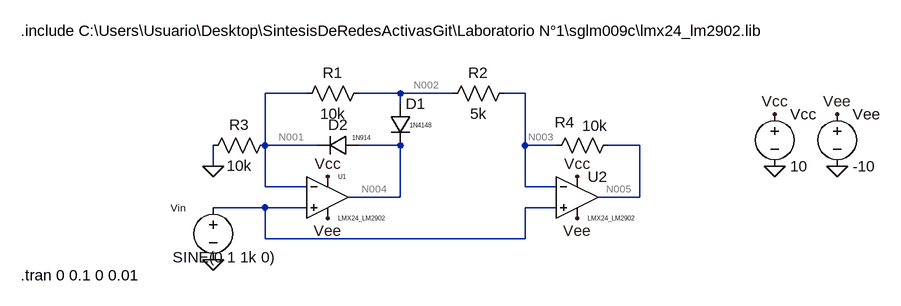
[diagram p0: schematic Laboratorio1-CircuitoIII.asc]
Laboratorio1-CircuitoIII.asc, the LTspice schematic file:
Version 4
SHEET 1 1160 680
WIRE 192 0 128 0
WIRE 336 0 272 0
WIRE 416 0 336 0
WIRE 528 0 496 0
WIRE 336 16 336 0
WIRE 128 80 128 0
WIRE 208 80 128 80
WIRE 336 80 272 80
WIRE 528 80 528 0
WIRE 576 80 528 80
WIRE 704 80 656 80
WIRE 48 112 48 80
WIRE 128 144 128 80
WIRE 192 144 128 144
WIRE 528 144 528 80
WIRE 576 144 528 144
WIRE 336 160 336 80
WIRE 336 160 256 160
WIRE 704 160 704 80
WIRE 704 160 640 160
WIRE 128 176 48 176
WIRE 192 176 128 176
WIRE 576 176 528 176
WIRE 128 224 128 176
WIRE 528 224 528 176
WIRE 528 224 128 224
FLAG 48 112 0
FLAG 48 256 0
FLAG 912 112 0
FLAG 1008 112 0
FLAG 912 32 Vcc
FLAG 608 128 Vcc
FLAG 224 128 Vcc
FLAG 1008 32 Vee
FLAG 608 192 Vee
FLAG 224 192 Vee
SYMBOL OpAmps\\opamp2 224 96 R0
WINDOW 3 16 96 Left 0
WINDOW 0 16 32 Left 0
SYMATTR Value LMX24_LM2902
SYMATTR InstName U1
SYMBOL OpAmps\\opamp2 608 96 R0
WINDOW 3 16 96 Left 0
SYMATTR Value LMX24_LM2902
SYMATTR InstName U2
SYMBOL diode 320 16 R0
WINDOW 3 30 33 Left 0
SYMATTR InstName D1
SYMATTR Value 1N4148
SYMBOL diode 272 96 M270
WINDOW 0 32 32 VTop 2
WINDOW 3 34 -5 VBottom 0
SYMATTR InstName D2
SYMATTR Value 1N914
SYMBOL res 288 -16 R90
WINDOW 0 0 56 VBottom 2
WINDOW 3 32 56 VTop 2
SYMATTR InstName R1
SYMATTR Value 10k
SYMBOL res 512 -16 R90
WINDOW 0 0 56 VBottom 2
WINDOW 3 32 56 VTop 2
SYMATTR InstName R2
SYMATTR Value 5k
SYMBOL res 144 64 R90
WINDOW 0 0 56 VBottom 2
WINDOW 3 32 56 VTop 2
SYMATTR InstName R3
SYMATTR Value 10k
SYMBOL res 672 64 R90
WINDOW 0 -4 83 VBottom 2
WINDOW 3 -30 37 VTop 2
SYMATTR InstName R4
SYMATTR Value 10k
SYMBOL voltage 912 16 R0
SYMATTR InstName Vcc
SYMATTR Value 10
SYMBOL voltage 1008 16 R0
SYMATTR InstName Vee
SYMATTR Value -10
SYMBOL voltage 48 160 R0
WINDOW 0 -65 16 Left 1
WINDOW 3 -62 92 Left 2
WINDOW 123 0 0 Left 0
WINDOW 39 0 0 Left 0
SYMATTR InstName Vin
SYMATTR Value SINE(0 1 1k 0)
TEXT -248 -96 Left 2 !.include C:\\Users\\Usuario\\Desktop\\SintesisDeRedesActivasGit\\Laboratorio N°1\\sglm009c\\lmx24_lm2902.lib
TEXT -248 280 Left 2 !.tran 0 0.1 0 0.01

The netlist it stands for:
* Laboratorio1-CircuitoIII.asc
XU1 N006 N001 Vcc Vee N004 LMX24_LM2902  ; pins In+ In- V+ V- OUT
XU2 N006 N003 Vcc Vee N005 LMX24_LM2902  ; pins In+ In- V+ V- OUT
D1 N002 N004 1N4148
D2 N004 N001 1N914
R1 N002 N001 10k
R2 N003 N002 5k
R3 N001 0 10k
R4 N005 N003 10k
Vcc Vcc 0 10
Vee Vee 0 -10
Vin N006 0 SINE(0 1 1k 0)
.model D D
.lib standard.dio
.include C:\Users\Usuario\Desktop\SintesisDeRedesActivasGit\Laboratorio N°1\sglm009c\lmx24_lm2902.lib
.tran 0 0.1 0 0.01
.backanno
.end

* Results of the author's LTspice run, read from the files saved beside the schematic
* Operating Point, zero values left out:
*   V(n004) = 209.8 mV
*   V(vcc) = 10 V
*   V(vee) = -10 V
*   V(n001) = 2.602 mV
*   V(n005) = 2.41 mV
*   V(n003) = 2.604 mV
*   V(n002) = 2.612 mV
*   I(D2) = 241.1 nA
*   I(D1) = -2.494 nA
*   I(R4) = -19.48 nA
*   I(R3) = 260.2 nA
*   I(R2) = -1.477 nA
*   I(R1) = 1.017 nA
*   I(Vin) = 40 nA
*   I(Vee) = 350 µA
*   I(Vcc) = -350.2 µA
*   Ix(u1:IN+) = -20 nA
*   Ix(u1:IN-) = -18 nA
*   Ix(u1:VCC) = 175.2 µA
*   Ix(u1:VEE) = -175 µA
*   Ix(u1:OUT) = -243.6 nA
*   Ix(u2:IN+) = -20 nA
*   Ix(u2:IN-) = -18 nA
*   Ix(u2:VCC) = 175 µA
*   Ix(u2:VEE) = -175 µA
*   Ix(u2:OUT) = 19.48 nA
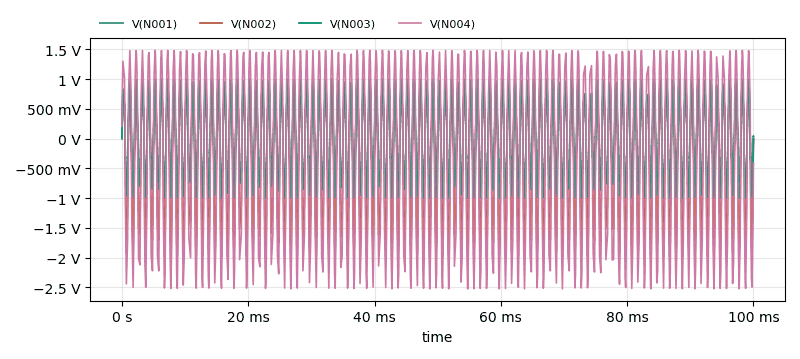
[diagram p1: Transient Analysis of Laboratorio1-CircuitoIII.asc, plotted from the saved traces]
* Transient Analysis, 1 run:
*   V(N001): min -996.1 mV, max 1 V, average 3.077 mV, rms 701.8 mV, last -8.356 mV
*   V(N002): min -1.992 V, max 1 V, average -310 mV, rms 1.107 V, last -20.26 mV
*   V(N003): min -996 mV, max 1 V, average 2.987 mV, rms 701.9 mV, last 39.38 mV
*   V(N004): min -2.525 V, max 1.483 V, average -334.7 mV, rms 1.547 V, last -411.4 mV